# EAGLE schematic nixie_tester (EAGLE 9.2.2)
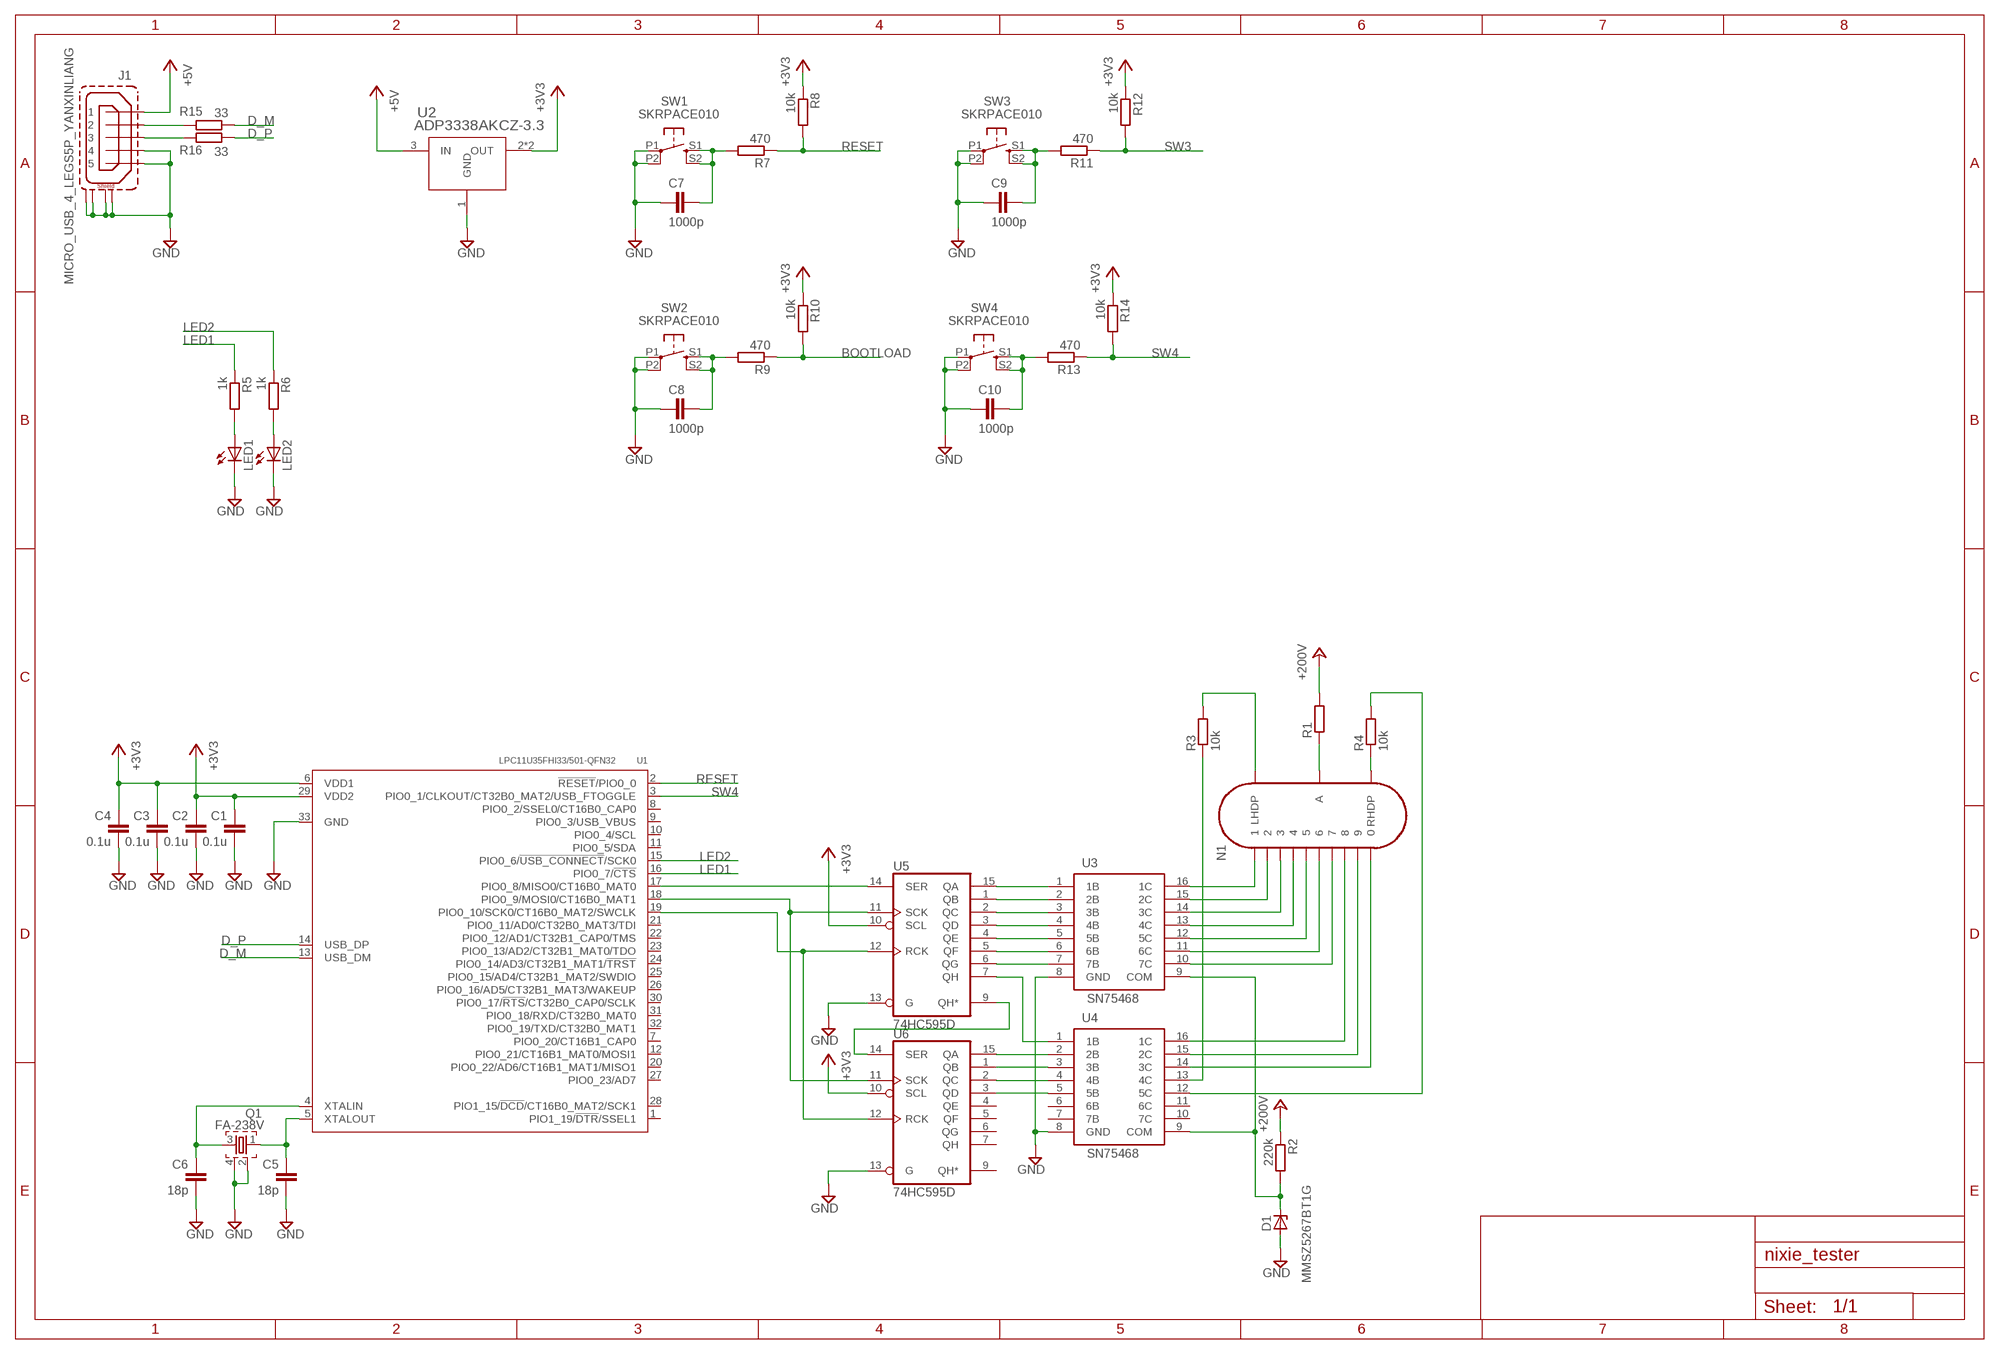
[diagram p0: schematic, sheet 1]

## Parts
C1  0.1u  C-EUC0603  [C0603]
C2  0.1u  C-EUC0603  [C0603]
C3  0.1u  C-EUC0603  [C0603]
C4  0.1u  C-EUC0603  [C0603]
C5  18p  C-EUC0603  [C0603]
C6  18p  C-EUC0603  [C0603]
C7  1000p  C-EUC0603  [C0603]
C8  1000p  C-EUC0603  [C0603]
C9  1000p  C-EUC0603  [C0603]
C10  1000p  C-EUC0603  [C0603]
D1  MMSZ5267BT1G  [SOD123]
J1  MICRO_USB_4_LEGS5P_YANXINLIANG  [MICRO_USB_4_LEGS5P_YANXINLIANG]
LED1  LEDCHIPLED_0603  [CHIPLED_0603]
LED2  LEDCHIPLED_0603  [CHIPLED_0603]
N1  IN-14  [IN-14]
Q1  FA-238V  [FA238-V]
R1  R-EU_R1206  [R1206]
R2  220k  R-EU_R0603  [R0603]
R3  10k  R-EU_R0603  [R0603]
R4  10k  R-EU_R0603  [R0603]
R5  1k  R-EU_R0603  [R0603]
R6  1k  R-EU_R0603  [R0603]
R7  470  R-EU_R0603  [R0603]
R8  10k  R-EU_R0603  [R0603]
R9  470  R-EU_R0603  [R0603]
R10  10k  R-EU_R0603  [R0603]
R11  470  R-EU_R0603  [R0603]
R12  10k  R-EU_R0603  [R0603]
R13  470  R-EU_R0603  [R0603]
R14  10k  R-EU_R0603  [R0603]
R15  33  R-EU_R0603  [R0603]
R16  33  R-EU_R0603  [R0603]
SW1  SKRPACE010  [SKRPACE010]
SW2  SKRPACE010  [SKRPACE010]
SW3  SKRPACE010  [SKRPACE010]
SW4  SKRPACE010  [SKRPACE010]
U1  LPC11U35FHI33/501-QFN32  MCU-LPC11U35FHI33/501(QFN32)  [QFN32G-0.5-5X5MM]
U2  ADP3338AKCZ-3.3  [SOT233]
U3  SN75468  [R-PDSO-G16]
U4  SN75468  [R-PDSO-G16]
U5  74HC595D  [SO16]
U6  74HC595D  [SO16]

## Nets
+3V3: C1.1 C2.1 C3.1 C4.1 R8.1 R10.1 R12.1 R14.1 U1.6(VDD1) U1.29(VDD2) U2.2(OUT) U2.4(OUT) U5.10(SCL) U6.10(SCL)
+5V: J1.1 U2.3(IN)
+200V: R1.2 R2.1
BOOTLOAD: R9.1 R10.2
D_M: R15.1 U1.13(USB_DM)
D_P: R16.1 U1.14(USB_DP)
GND: C1.2 C2.2 C3.2 C4.2 C5.2 C6.2 C7.1 C8.1 C9.1 C10.1 D1.A J1.4 J1.5 J1.S3 J1.S4 J1.S5 J1.S6 LED1.C LED2.C Q1.2 Q1.4 SW1.P1(P) SW1.P2(P1) SW2.P1(P) SW2.P2(P1) SW3.P1(P) SW3.P2(P1) SW4.P1(P) SW4.P2(P1) U1.33(GND) U2.1(GND) U3.8(GND) U4.8(GND) U5.13(G) U6.13(G)
LED1: R5.1 U1.16(PIO0_7/!CTS!)
LED2: R6.1 U1.15(PIO0_6/!USB_CONNECT!/SCK0)
N$1: N1.1 U3.16(1C)
N$2: N1.2 U3.15(2C)
N$3: N1.3 U3.14(3C)
N$4: N1.4 U3.13(4C)
N$5: N1.5 U3.12(5C)
N$6: N1.6 U3.11(6C)
N$7: N1.7 U3.10(7C)
N$8: N1.8 U4.16(1C)
N$9: N1.9 U4.15(2C)
N$10: N1.0 U4.14(3C)
N$11: R3.1 U4.13(4C)
N$12: R4.2 U4.12(5C)
N$13: N1.A R1.1
N$14: D1.K(C) R2.2 U3.9(COM) U4.9(COM)
N$15: N1.LHDP R3.2
N$16: N1.RHDP R4.1
N$17: LED1.A R5.2
N$18: C6.1 Q1.3 U1.4(XTALIN)
N$19: C5.1 Q1.1 U1.5(XTALOUT)
N$20: LED2.A R6.2
N$21: C7.2 R7.2 SW1.S1(S) SW1.S2(S1)
N$22: C8.2 R9.2 SW2.S1(S) SW2.S2(S1)
N$23: U3.1(1B) U5.15(QA)
N$24: U3.2(2B) U5.1(QB)
N$25: U3.3(3B) U5.2(QC)
N$26: U3.4(4B) U5.3(QD)
N$27: U3.5(5B) U5.4(QE)
N$28: U3.6(6B) U5.5(QF)
N$29: U3.7(7B) U5.6(QG)
N$30: U4.1(1B) U5.7(QH)
N$31: U5.9(QH*) U6.14(SER)
N$32: U4.2(2B) U6.15(QA)
N$33: U4.3(3B) U6.1(QB)
N$34: U4.4(4B) U6.2(QC)
N$35: U4.5(5B) U6.3(QD)
N$36: U1.18(PIO0_9/MOSI0/CT16B0_MAT1) U5.11(SCK) U6.11(SCK)
N$37: U1.19(PIO0_10/SCK0/CT16B0_MAT2/SWCLK) U5.12(RCK) U6.12(RCK)
N$38: U1.17(PIO0_8/MISO0/CT16B0_MAT0) U5.14(SER)
N$39: C9.2 R11.2 SW3.S1(S) SW3.S2(S1)
N$40: C10.2 R13.2 SW4.S1(S) SW4.S2(S1)
N$41: J1.2 R15.2
N$42: J1.3 R16.2
RESET: R7.1 R8.2 U1.2(!RESET!/PIO0_0)
SW3: R11.1 R12.2
SW4: R13.1 R14.2 U1.3(PIO0_1/CLKOUT/CT32B0_MAT2/USB_FTOGGLE)
Unconnected: U1.1(PIO1_19/!DTR!/SSEL1) U1.7(PIO0_20/CT16B1_CAP0) U1.8(PIO0_2/SSEL0/CT16B0_CAP0) U1.9(PIO0_3/USB_VBUS) U1.10(PIO0_4/SCL) U1.11(PIO0_5/SDA) U1.12(PIO0_21/CT16B1_MAT0/MOSI1) U1.20(PIO0_22/AD6/CT16B1_MAT1/MISO1) U1.21(PIO0_11/AD0/CT32B0_MAT3/TDI) U1.22(PIO0_12/AD1/CT32B1_CAP0/TMS) U1.23(PIO0_13/AD2/CT32B1_MAT0/TDO) U1.24(PIO0_14/AD3/CT32B1_MAT1/!TRST!) U1.25(PIO0_15/AD4/CT32B1_MAT2/SWDIO) U1.26(PIO0_16/AD5/CT32B1_MAT3/WAKEUP) U1.27(PIO0_23/AD7) U1.28(PIO1_15/!DCD!/CT16B0_MAT2/SCK1) U1.30(PIO0_17/!RTS!/CT32B0_CAP0/SCLK) U1.31(PIO0_18/RXD/CT32B0_MAT0) U1.32(PIO0_19/TXD/CT32B0_MAT1) U4.6(6B) U4.7(7B) U4.10(7C) U4.11(6C) U6.4(QE) U6.5(QF) U6.6(QG) U6.7(QH) U6.9(QH*)

## Power pins joined to a net without a drawn wire
GND: U5.8(GND) U6.8(GND)
VCC: U5.16(VCC) U6.16(VCC)

## Library data of the parts
C1-C10 = taki-library:C-EU: CAPACITOR, European symbol
D1 = taki-library:MMSZ5267BT1G
J1 = taki-library:MICRO_USB_4_LEGS5P_YANXINLIANG
LED1 LED2 = taki-library:LED: LED OSRAM: - CHIPLED LG R971, LG N971, LY N971, LG Q971, LY Q971, LO R971, LY R971 LH N974, LH R974 LS Q976, LO Q976, LY Q976 LO Q996 - Hyper CHIPLED LW Q18S LB Q993, LB Q99A, LB R99A - SideLED LS A670, LO A670, LY A670, LG A670, LP A670 LB A673, LV A673, LT A673, LW A673 LH A674 LY A675 LS A676, LA A676, LO A676, LY A676, LW A676 LS A679, LY A679, LG A679 - Hyper Micro SIDELED® LS Y876, LA Y876, LO Y876, LY Y876 LT Y87S - SmartLED LW L88C, LW L88S LB L89C, LB L89S, LG L890 LS L89K, LO L89K, LY L89K LS L896, LA L896, LO L896, LY L896 - TOPLED LS T670, LO T670, LY T670, LG T670, LP T670 LSG T670, LSP T670, LSY T670, LOP T670, LYG T670 LG T671, LOG T671, LSG T671 LB T673, LV T673, LT T673, LW T673 LH T674 LS T676, LA T676, LO T676, LY T676, LB T676, LH T676, LSB T676, LW T676 LB T67C, LV T67C, LT T67C, LS T67K, LO T67K, LY T67K, LW E67C LS E67B, LA E67B, LO E67B, LY E67B, LB E67C, LV E67C, LT E67C LW T67C LS T679, LY T679, LG T679 LS T770, LO T770, LY T770, LG T770, LP T770 LB T773, LV T773, LT T773, LW T773 LH T774 LS E675, LA E675, LY E675, LS T675 LS T776, LA T776, LO T776, LY T776, LB T776 LHGB T686 LT T68C, LB T68C - Hyper Mini TOPLED® LB M676 - Mini TOPLED Santana® LG M470 LS M47K, LO M47K, LY M47K Source: http://www.osram.convergy.de LUXEON: - LUMILED® LXK2-PW12-R00, LXK2-PW12-S00, LXK2-PW14-U00, LXK2-PW14-V00 LXK2-PM12-R00, LXK2-PM12-S00, LXK2-PM14-U00 LXK2-PE12-Q00, LXK2-PE12-R00, LXK2-PE12-S00, LXK2-PE14-T00, LXK2-PE14-U00 LXK2-PB12-K00, LXK2-PB12-L00, LXK2-PB12-M00, LXK2-PB14-N00, LXK2-PB14-P00, LXK2-PB14-Q00 LXK2-PR12-L00, LXK2-PR12-M00, LXK2-PR14-Q00, LXK2-PR14-R00 LXK2-PD12-Q00, LXK2-PD12-R00, LXK2-PD12-S00 LXK2-PH12-R00, LXK2-PH12-S00 LXK2-PL12-P00, LXK2-PL12-Q00, LXK2-PL12-R00 Source: www.luxeon.com KINGBRIGHT: KA-3528ASYC Source: www.kingbright.com
N1 = taki-library:IN-14: IN-14: medium numeric frontview nixie tube
Q1 = taki-library:FA-238V
R1-R16 = taki-library:R-EU_: RESISTOR, European symbol
SW1-SW4 = taki-library:SKRPACE010
U1 = taki-library:MCU-LPC11U35FHI33/501(QFN32): 310010053; MPN: LPC11U35FHI33/501
U2 = taki-library:ADP3338AKCZ-3.3
U3 U4 = taki-library:SN75468
U5 U6 = taki-library:74*595: 8-bit SHIFT REGISTER, output latch

## Net classes
0 default: width 0.152 mm
1 POWER: width 0.152 mm